# Altium schematic sheet MCU.SchDoc
size A4
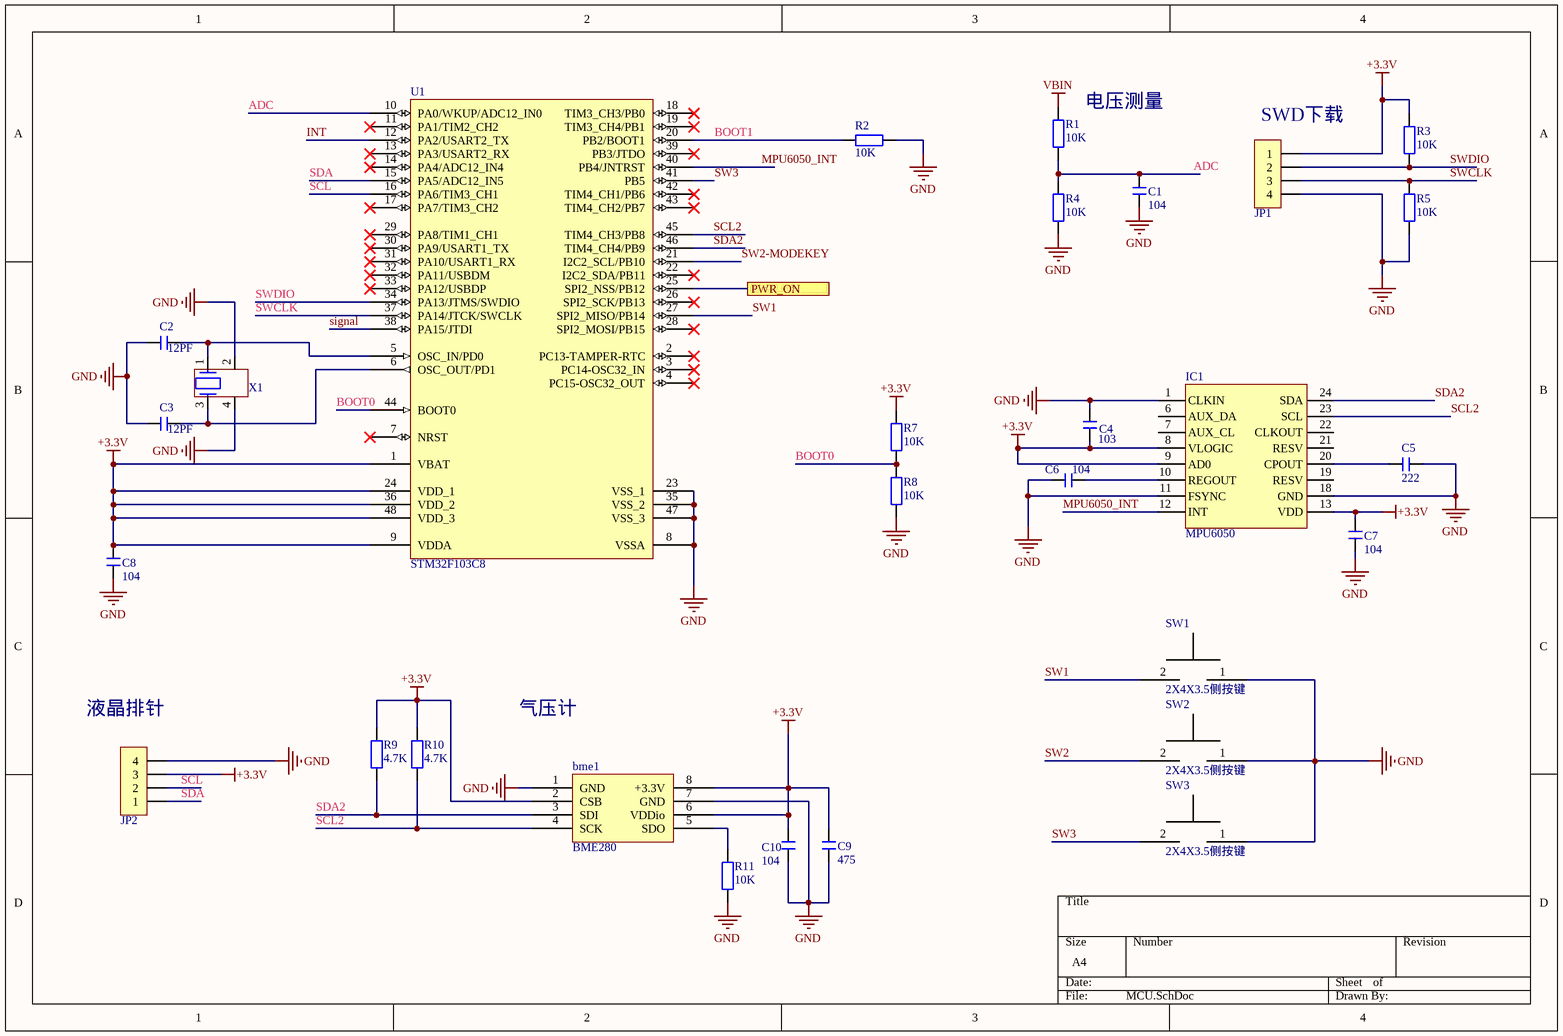
[diagram p0: MCU.SchDoc]

## Parts
bme1  BME280  [BME280]
C1  104  [C0805]
C2  12PF  [C0603]
C3  12PF  [C0603]
C4  103  [C0805]
C5  222  [C0603]
C6  104  [C0805]
C7  104  [C0805]
C8  104  [C0805]
C9  475  [C0603]
C10  104  [C0805]
IC1  MPU6050  [QFN24 4x4_M]
JP1  HDR-1X4  [HDR1X4]  (value not drawn)
JP2  HDR-1X4  [HDR2.54-LI-4P]  (value not drawn)
R1  10K  [R0805]
R2  10K  [R0805]
R3  10K  [R0805]
R4  10K  [R0805]
R5  10K  [R0805]
R7  10K  [R0805]
R8  10K  [R0805]
R9  4.7K  [R0805]
R10  4.7K  [R0805]
R11  10K  [R0805]
SW1  2X4X3.5侧按键  [2X4X3.5贴片侧按开关]
SW2  2X4X3.5侧按键  [2X4X3.5贴片侧按开关]
SW3  2X4X3.5侧按键  [2X4X3.5贴片侧按开关]
U1  STM32F103C8  [LQFP48 7X7_M]
X1  YSX321SL 8MHz 12pF  [3225-4N]  (value not drawn)

## Ports
PWR_ON

## Nets
+3.3V: bme1.2(CSB) bme1.6(VDDio) bme1.8(+3.3V) C4.1 C7.2 C8.2 C9.2 C10.2 IC1.8(VLOGIC) IC1.9(AD0) IC1.13(VDD) JP1.1 JP2.3 R3.2 R7.2 R9.2 R10.2 U1.1(VBAT) U1.9(VDDA) U1.24(VDD_1) U1.36(VDD_2) U1.48(VDD_3)
GND: bme1.1(GND) bme1.7(GND) C1.1 C2.1 C3.1 C4.2 C5.1 C6.2 C7.1 C8.1 C9.1 C10.1 IC1.1(CLKIN) IC1.11(FSYNC) IC1.18(GND) JP1.4 JP2.4 R2.2 R4.1 R5.1 R8.1 R11.1 SW1.1 SW2.1 SW3.1 U1.8(VSSA) U1.23(VSS_1) U1.35(VSS_2) U1.47(VSS_3) X1.2 X1.4
VBIN: R1.2
ADC: C1.2 R1.1 R4.2 U1.10(PA0/WKUP/ADC12_IN0)
BOOT0: R7.1 R8.2 U1.44(BOOT0)
BOOT1: R2.1 U1.20(PB2/BOOT1)
INT: U1.12(PA2/USART2_TX)
MPU6050_INT: IC1.12(INT) U1.40(PB4/JNTRST)
PWR_ON: U1.25(SPI2_NSS/PB12) ; port PWR_ON
SCL: JP2.2 U1.16(PA6/TIM3_CH1)
SCL2: bme1.4(SCK) IC1.23(SCL) R10.1 U1.45(TIM4_CH3/PB8)
SDA: JP2.1 U1.15(PA5/ADC12_IN5)
SDA2: bme1.3(SDI) IC1.24(SDA) R9.1 U1.46(TIM4_CH4/PB9)
signal: U1.38(PA15/JTDI)
SW1: SW1.2 U1.27(SPI2_MISO/PB14)
SW2: SW2.2
SW2-MODEKEY: U1.21(I2C2_SCL/PB10)
SW3: SW3.2 U1.41(PB5)
SWCLK: JP1.3 R5.2 U1.37(PA14/JTCK/SWCLK)
SWDIO: JP1.2 R3.1 U1.34(PA13/JTMS/SWDIO)
Netbme1_5: bme1.5(SDO) R11.2
NetC2_2: C2.2 U1.5(OSC_IN/PD0) X1.1
NetC3_2: C3.2 U1.6(OSC_OUT/PD1) X1.3
NetC5_2: C5.2 IC1.20(CPOUT)
NetC6_1: C6.1 IC1.10(REGOUT)

Not connected (* = marked no-connect by the designer): IC1 6(AUX_DA) 7(AUX_CL) 19(RESV) 21(RESV) 22(CLKOUT); U1 2(PC13-TAMPER-RTC)* 3(PC14-OSC32_IN)* 4(PC15-OSC32_OUT)* 7(NRST)* 11(PA1/TIM2_CH2)* 13(PA3/USART2_RX)* 14(PA4/ADC12_IN4)* 17(PA7/TIM3_CH2)* 18(TIM3_CH3/PB0)* 19(TIM3_CH4/PB1)* 22(I2C2_SDA/PB11)* 26(SPI2_SCK/PB13)* 28(SPI2_MOSI/PB15)* 29(PA8/TIM1_CH1)* 30(PA9/USART1_TX)* 31(PA10/USART1_RX)* 32(PA11/USBDM)* 33(PA12/USBDP)* 39(PB3/JTDO)* 42(TIM4_CH1/PB6)* 43(TIM4_CH2/PB7)*

## Notes on the sheet
- (near R1) 电压测量
- (near JP1) SWD下载
- (near JP2) 液晶排针
- 气压计

## Library data of the parts
bme1 = BME280: 气压，湿度，温度传感器
C1-C3 C8-C10 = C: 无极性贴片电容; 版权归属: 源创客; 材质: X7R; BOM名称: 无极性贴片电容; 学习资源: www.ooocke.com
C4-C7 = C: 无极性贴片电容; 版权归属: 源创客; BOM名称: 无极性贴片电容; 学习资源: www.ooocke.com
IC1 = MPU6050: 陀螺仪
JP1 = Header 4: 4P接插件（SWD下载）; Manufacturer: HX(红星)
JP2 = Header 4: 4P接插件; 版权归属: 源创客; BOM名称: 4P接插件; 学习资源: www.ooocke.com
R1-R5 R7-R11 = R: 贴片电阻; 版权归属: 源创客; BOM名称: 贴片电阻; 学习资源: www.ooocke.com
U1 = STM32F103C8: Flaah:64/RAM:20/IO:36; BOM名称: 32位STM单片机; 版权归属: 源创客; 学习资源: www.ooocke.com
X1 = XTAL_4_PINS: Crystal 8MHz, 12pF; Value: YSX321SL 8MHz 12pF; Package: NX2016SA